# Altium project Led7Segment_Project.PrjPcb
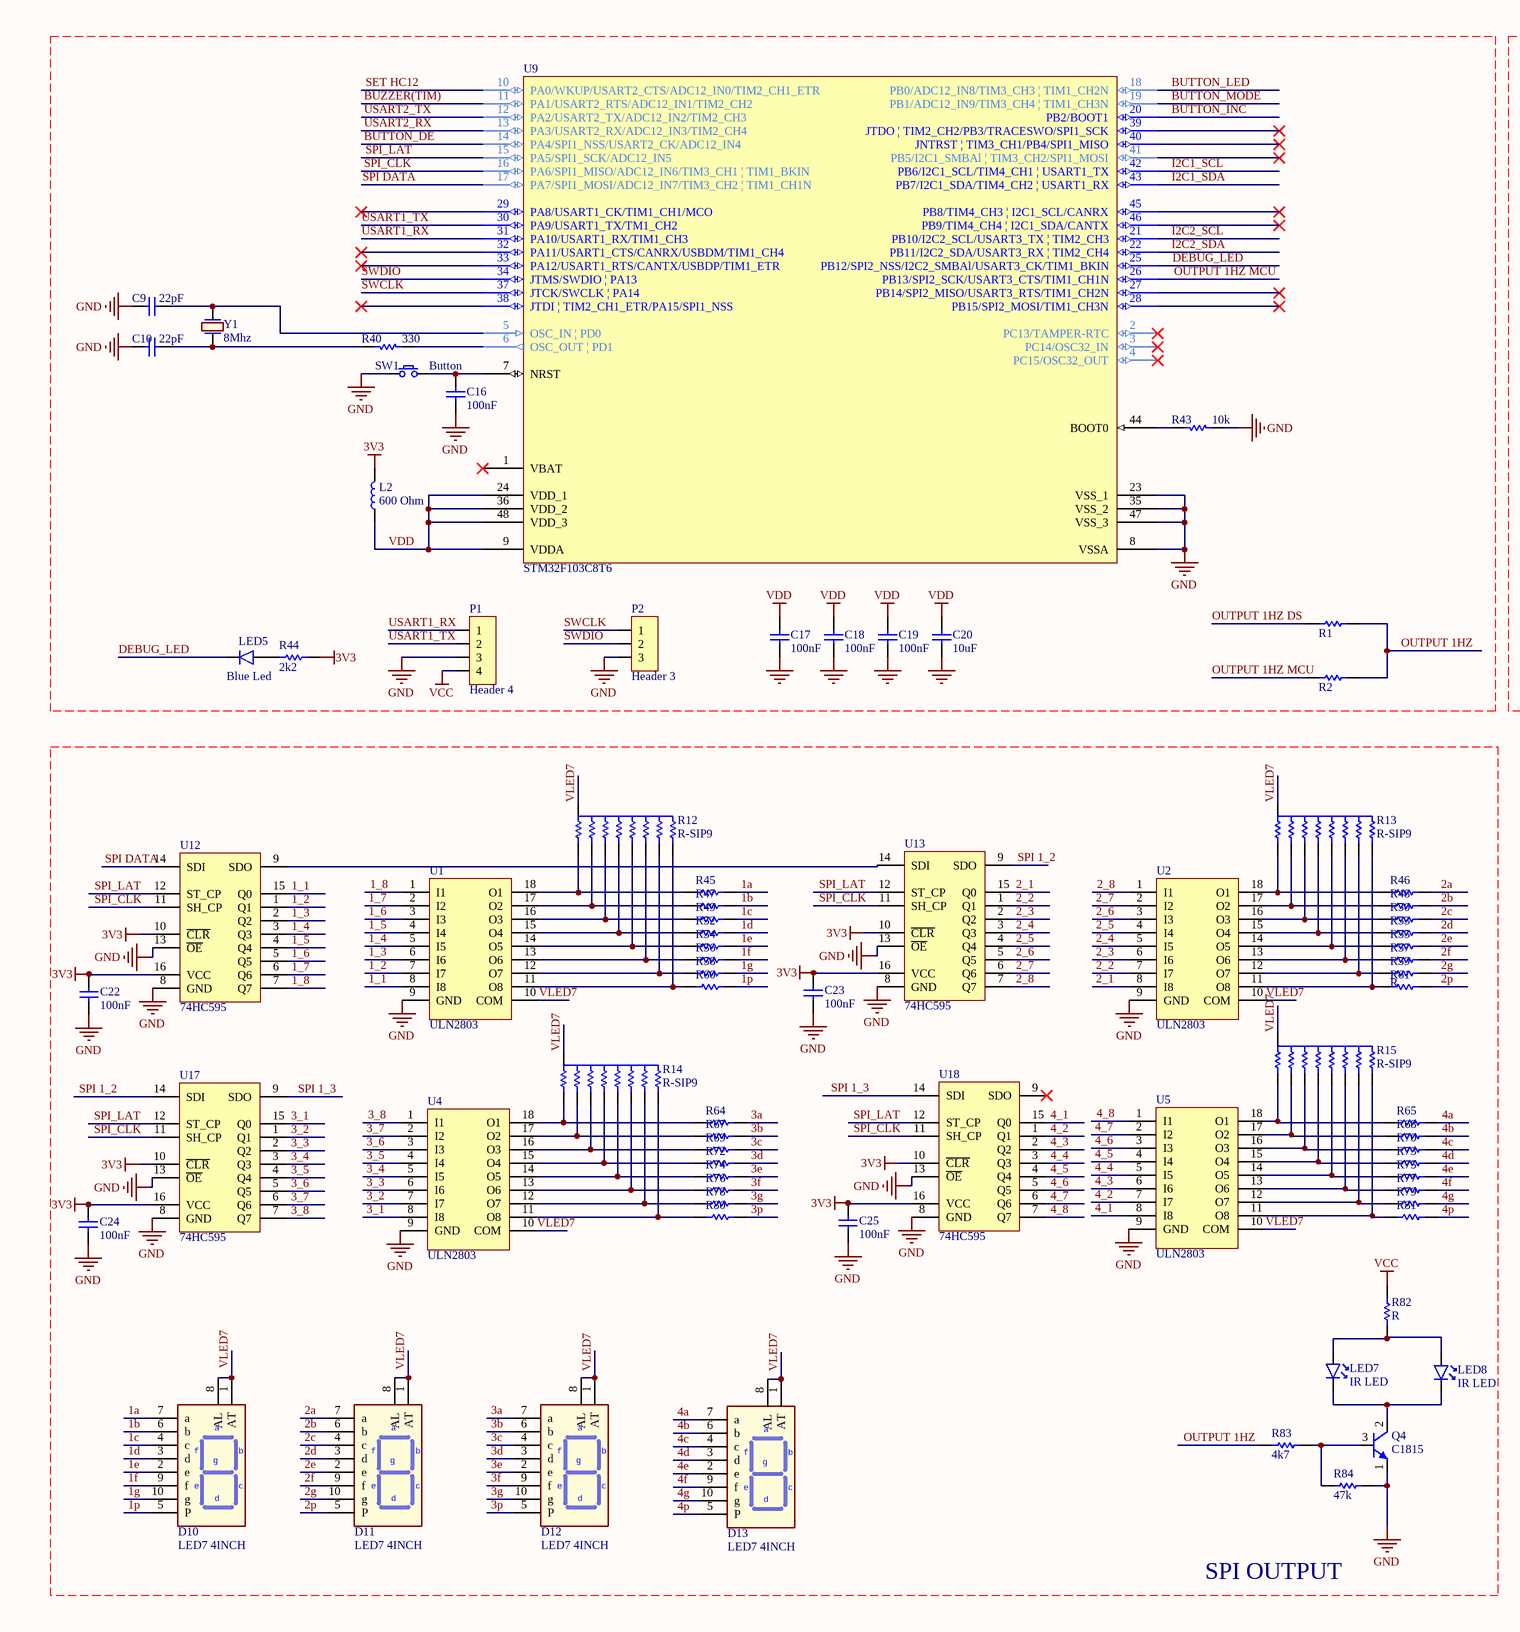
[diagram p0: MainBoard.SchDoc, left]
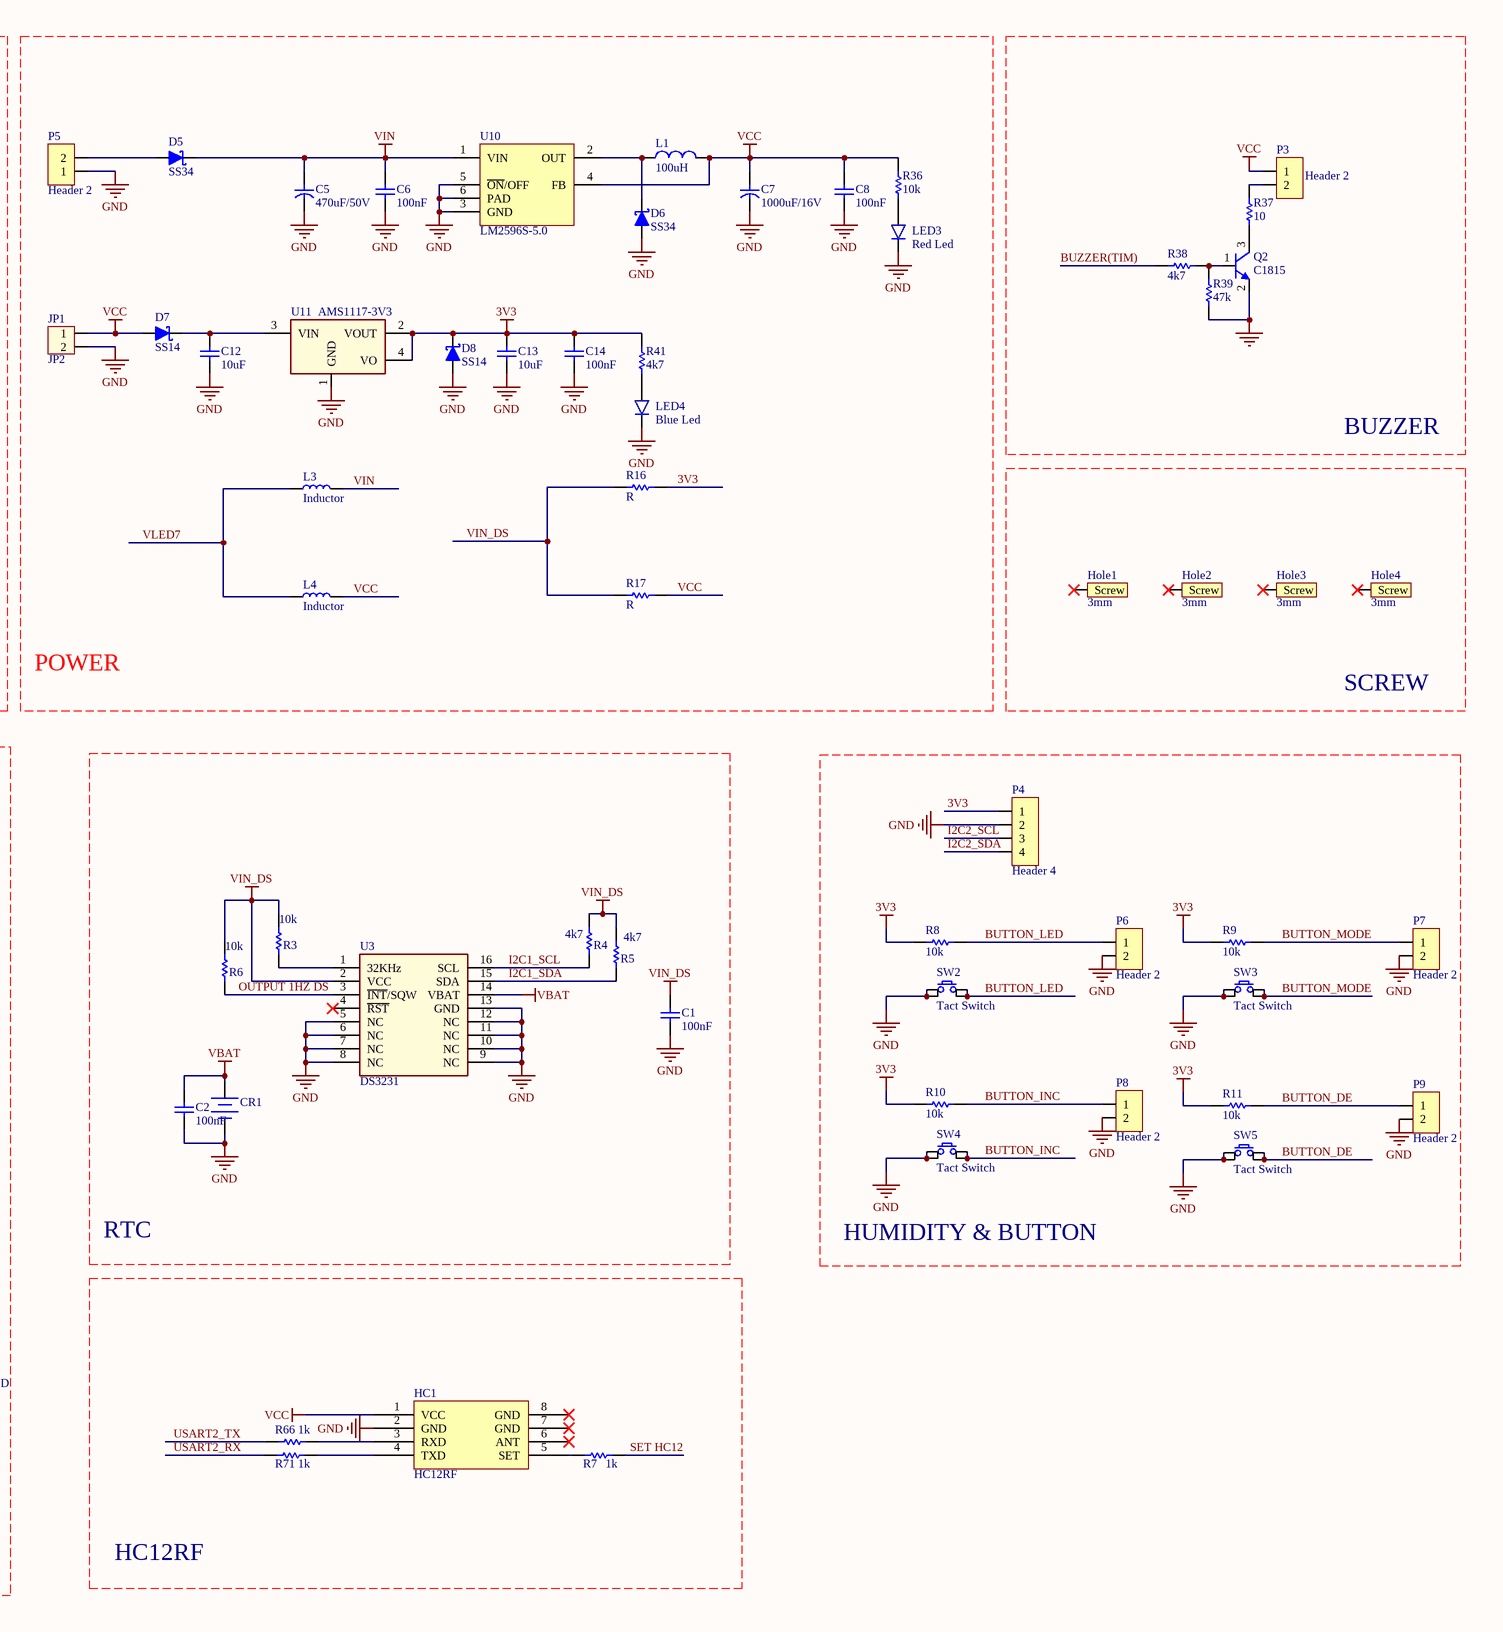
[diagram p1: MainBoard.SchDoc, right]
1 sheet, 135 parts. Net scope: global (net labels, ports and power ports of the same name join across sheets).
Board file: PCB_Project.PcbDoc

## Sheet MainBoard.SchDoc
size A2

### Parts
C1  100nF  [C 0805 (2012)]
C2  100nF  [C 0805 (2012)]
C5  470uF/50V  [CR/D.10.0x16.0/P.5.0]
C6  100nF  [C 0805 (2012)]
C7  1000uF/16V  [CR/D.10.0x12.5/P.5.0]
C8  100nF  [C 0805 (2012)]
C9  22pF  [C 0805 (2012)]
C10  22pF  [C 0805 (2012)]
C12  10uF  [C 0805 (2012)]
C13  10uF  [C 0805 (2012)]
C14  100nF  [C 0805 (2012)]
C16  100nF  [C 0805 (2012)]
C17  100nF  [C 0805 (2012)]
C18  100nF  [C 0805 (2012)]
C19  100nF  [C 0805 (2012)]
C20  10uF  [C 0805 (2012)]
C22  100nF  [C 0805 (2012)]
C23  100nF  [C 0805 (2012)]
C24  100nF  [C 0805 (2012)]
C25  100nF  [C 0805 (2012)]
CR1  (no value)  [CON CR1220]
D5  SS34  [DO-214AC (SMA)]
D6  SS34  [DO-214AC (SMA)]
D7  SS14  [DO-214AC (SMA)]
D8  SS14  [DO-214AC (SMA)]
D10  LED7 4INCH  [LED7 CA 4INCH]
D11  LED7 4INCH  [LED7 CA 4INCH]
D12  LED7 4INCH  [LED7 CA 4INCH]
D13  LED7 4INCH  [LED7 CA 4INCH]
HC1  HC12RF  [HC12RF]
Hole1  3mm  [SCREW/3M/7M]
Hole2  3mm  [SCREW/3M/7M]
Hole3  3mm  [SCREW/3M/7M]
Hole4  3mm  [SCREW/3M/7M]
JP1  JP2  [CON Header 2]
L1  100uH  [Inductor SMD 12x12x8]
L2  600 Ohm  [Inductor SMD 0805 (2012)]
L3  Inductor  [Inductor SMD 7.5x7.0x5.0]
L4  Inductor  [Inductor SMD 7.5x7.0x5.0]
LED3  Red Led  [Led SMD 0805]
LED4  Blue Led  [Led SMD 0805]
LED5  Blue Led  [Led SMD 0805]
LED7  IR LED  [LED 5MM]
LED8  IR LED  [LED 5MM]
P1  Header 4  [CON Header 4]
P2  Header 3  [Header 3]
P3  Header 2  [CON Header 2]
P4  Header 4  [Header 4]
P5  Header 2  [HDR Domino 2]
P6  Header 2  [CON Header 2]
P7  Header 2  [CON Header 2]
P8  Header 2  [CON Header 2]
P9  Header 2  [CON Header 2]
Q2  C1815  [SOT-23]
Q4  C1815  [SOT-23]
R1  R  [R 0805 (2012)]  (value not drawn)
R2  R  [R 0805 (2012)]  (value not drawn)
R3  10k  [R 0805 (2012)]
R4  4k7  [R 0805 (2012)]
R5  4k7  [R 0805 (2012)]
R6  10k  [R 0805 (2012)]
R7  1k  [R 0805 (2012)]
R8  10k  [R 0805 (2012)]
R9  10k  [R 0805 (2012)]
R10  10k  [R 0805 (2012)]
R11  10k  [R 0805 (2012)]
R12  R-SIP9  [R SIP9]
R13  R-SIP9  [R SIP9]
R14  R-SIP9  [R SIP9]
R15  R-SIP9  [R SIP9]
R16  R  [R 0805 (2012)]
R17  R  [R 0805 (2012)]
R36  10k  [R 0805 (2012)]
R37  10  [R 0805 (2012)]
R38  4k7  [R 0805 (2012)]
R39  47k  [R 0805 (2012)]
R40  330  [R 0805 (2012)]
R41  4k7  [R 0805 (2012)]
R43  10k  [R 0805 (2012)]
R44  2k2  [R 0805 (2012)]
R45  R  [R 0805 (2012)]  (value not drawn)
R46  R  [R 0805 (2012)]  (value not drawn)
R47  R  [R 0805 (2012)]  (value not drawn)
R48  R  [R 0805 (2012)]  (value not drawn)
R49  R  [R 0805 (2012)]  (value not drawn)
R50  R  [R 0805 (2012)]  (value not drawn)
R52  R  [R 0805 (2012)]  (value not drawn)
R53  R  [R 0805 (2012)]  (value not drawn)
R54  R  [R 0805 (2012)]  (value not drawn)
R55  R  [R 0805 (2012)]  (value not drawn)
R56  R  [R 0805 (2012)]  (value not drawn)
R57  R  [R 0805 (2012)]  (value not drawn)
R58  R  [R 0805 (2012)]  (value not drawn)
R59  R  [R 0805 (2012)]
R60  R  [R 0805 (2012)]  (value not drawn)
R61  R  [R 0805 (2012)]  (value not drawn)
R64  R  [R 0805 (2012)]  (value not drawn)
R65  R  [R 0805 (2012)]  (value not drawn)
R66  1k  [R 0805 (2012)]
R67  R  [R 0805 (2012)]  (value not drawn)
R68  R  [R 0805 (2012)]  (value not drawn)
R69  R  [R 0805 (2012)]  (value not drawn)
R70  R  [R 0805 (2012)]  (value not drawn)
R71  1k  [R 0805 (2012)]
R72  R  [R 0805 (2012)]  (value not drawn)
R73  R  [R 0805 (2012)]  (value not drawn)
R74  R  [R 0805 (2012)]  (value not drawn)
R75  R  [R 0805 (2012)]  (value not drawn)
R76  R  [R 0805 (2012)]  (value not drawn)
R77  R  [R 0805 (2012)]  (value not drawn)
R78  R  [R 0805 (2012)]  (value not drawn)
R79  R  [R 0805 (2012)]  (value not drawn)
R80  R  [R 0805 (2012)]  (value not drawn)
R81  R  [R 0805 (2012)]  (value not drawn)
R82  R  [R 0805 (2012)]
R83  4k7  [R 0805 (2012)]
R84  47k  [R 0805 (2012)]
SW1  Button  [SW/2/SMD]
SW2  Tact Switch  [SW/4/SMD/SMALL]
SW3  Tact Switch  [SW/4/SMD/SMALL]
SW4  Tact Switch  [SW/4/SMD/SMALL]
SW5  Tact Switch  [SW/4/SMD/SMALL]
U1  ULN2803  [SOIC-18]
U2  ULN2803  [SOIC-18]
U3  DS3231  [SOIC-16-WIDE]
U4  ULN2803  [SOIC-18]
U5  ULN2803  [SOIC-18]
U9  STM32F103C8T6  [LQFP48_N]
U10  LM2596S-5.0  [TO-263-5]
U11  AMS1117-3V3  [SOT-223]
U12  74HC595  [SOIC-16]
U13  74HC595  [SOIC-16]
U17  74HC595  [SOIC-16]
U18  74HC595  [SOIC-16]
Y1  8Mhz  [Crystal HC49US SMD]

### Nets
3V3: C13.1 C14.1 C22.1 C23.1 C24.1 C25.1 D8.2(K) L2.2 P4.1 R8.1 R9.1 R10.1 R11.1 R16.2 R41.2 R44.2 U11.2(VOUT) U11.4(VO) U12.10(~{CLR}) U12.16(VCC) U13.10(~{CLR}) U13.16(VCC) U17.10(~{CLR}) U17.16(VCC) U18.10(~{CLR}) U18.16(VCC)
GND: C1.2 C2.2 C5.2 C6.2 C7.2 C8.2 C9.2 C10.2 C12.2 C13.2 C14.2 C16.2 C17.2 C18.2 C19.2 C20.2 C22.2 C23.2 C24.2 C25.2 CR1.2(GND) D6.1(A) D8.1(A) HC1.2(GND) JP1.2 LED3.2(K) LED4.2(K) P1.3 P2.3 P4.2 P5.1 P6.2 P7.2 P8.2 P9.2 Q2.2(E) Q4.1(E) R39.2 R43.1 R84.2 SW1.1 SW2.1 SW2.4 SW3.1 SW3.4 SW4.1 SW4.4 SW5.1 SW5.4 U1.9(GND) U2.9(GND) U3.5(NC) U3.6(NC) U3.7(NC) U3.8(NC) U3.9(NC) U3.10(NC) U3.11(NC) U3.12(NC) U3.13(GND) U4.9(GND) U5.9(GND) U9.8(VSSA) U9.23(VSS_1) U9.35(VSS_2) U9.47(VSS_3) U10.3(GND) U10.5(~{ON}/OFF) U10.6(GND) U11.1(GND) U12.8(GND) U12.13(~{OE}) U13.8(GND) U13.13(~{OE}) U17.8(GND) U17.13(~{OE}) U18.8(GND) U18.13(~{OE})
VBAT: C2.1 CR1.1(VCC) U3.14(VBAT)
VCC: C7.1 C8.1 D7.1(A) HC1.1(VCC) JP1.1 L1.2 L4.2 P1.4 P3.1 R17.2 R36.2 R82.2 U10.4(FB)
VDD: C17.1 C18.1 C19.1 C20.1 L2.1 U9.9(VDDA) U9.24(VDD_1) U9.36(VDD_2) U9.48(VDD_3)
VIN: C5.1 C6.1 D5.2(K) L3.2 U10.1(VIN)
VIN_DS: C1.1 R3.1 R4.2 R5.2 R6.2 R16.1 R17.1 U3.2(VCC)
1_1: U1.8(I8) U12.15(Q0)
1_2: U1.7(I7) U12.1(Q1)
1_3: U1.6(I6) U12.2(Q2)
1_4: U1.5(I5) U12.3(Q3)
1_5: U1.4(I4) U12.4(Q4)
1_6: U1.3(I3) U12.5(Q5)
1_7: U1.2(I2) U12.6(Q6)
1_8: U1.1(I1) U12.7(Q7)
1a: D10.7(a) R45.2
1b: D10.6(b) R47.2
1c: D10.4(c) R49.2
1d: D10.3(d) R52.2
1e: D10.2(e) R54.2
1f: D10.9(f) R56.2
1g: D10.10(g) R58.2
1p: D10.5(P) R60.2
2_1: U2.8(I8) U13.15(Q0)
2_2: U2.7(I7) U13.1(Q1)
2_3: U2.6(I6) U13.2(Q2)
2_4: U2.5(I5) U13.3(Q3)
2_5: U2.4(I4) U13.4(Q4)
2_6: U2.3(I3) U13.5(Q5)
2_7: U2.2(I2) U13.6(Q6)
2_8: U2.1(I1) U13.7(Q7)
2a: D11.7(a) R46.2
2b: D11.6(b) R48.2
2c: D11.4(c) R50.2
2d: D11.3(d) R53.2
2e: D11.2(e) R55.2
2f: D11.9(f) R57.2
2g: D11.10(g) R59.2
2p: D11.5(P) R61.2
3_1: U4.8(I8) U17.15(Q0)
3_2: U4.7(I7) U17.1(Q1)
3_3: U4.6(I6) U17.2(Q2)
3_4: U4.5(I5) U17.3(Q3)
3_5: U4.4(I4) U17.4(Q4)
3_6: U4.3(I3) U17.5(Q5)
3_7: U4.2(I2) U17.6(Q6)
3_8: U4.1(I1) U17.7(Q7)
3a: D12.7(a) R64.2
3b: D12.6(b) R67.2
3c: D12.4(c) R69.2
3d: D12.3(d) R72.2
3e: D12.2(e) R74.2
3f: D12.9(f) R76.2
3g: D12.10(g) R78.2
3p: D12.5(P) R80.2
4_1: U5.8(I8) U18.15(Q0)
4_2: U5.7(I7) U18.1(Q1)
4_3: U5.6(I6) U18.2(Q2)
4_4: U5.5(I5) U18.3(Q3)
4_5: U5.4(I4) U18.4(Q4)
4_6: U5.3(I3) U18.5(Q5)
4_7: U5.2(I2) U18.6(Q6)
4_8: U5.1(I1) U18.7(Q7)
4a: D13.7(a) R65.2
4b: D13.6(b) R68.2
4c: D13.4(c) R70.2
4d: D13.3(d) R73.2
4e: D13.2(e) R75.2
4f: D13.9(f) R77.2
4g: D13.10(g) R79.2
4p: D13.5(P) R81.2
BUTTON_DE: P9.1 R11.2 SW5.2 SW5.3 U9.14(PA4/SPI1_NSS/USART2_CK/ADC12_IN4)
BUTTON_INC: P8.1 R10.2 SW4.2 SW4.3 U9.20(PB2/BOOT1)
BUTTON_LED: P6.1 R8.2 SW2.2 SW2.3 U9.18(PB0/ADC12_IN8/TIM3_CH3_|_TIM1_CH2N)
BUTTON_MODE: P7.1 R9.2 SW3.2 SW3.3 U9.19(PB1/ADC12_IN9/TIM3_CH4_|_TIM1_CH3N)
BUZZER(TIM): R38.2 U9.11(PA1/USART2_RTS/ADC12_IN1/TIM2_CH2)
DEBUG_LED: LED5.2(K) U9.25(PB12/SPI2_NSS/I2C2_SMBAl/USART3_CK/TIM1_BKIN)
I2C1_SCL: R4.1 U3.16(SCL) U9.42(PB6/I2C1_SCL/TIM4_CH1_|_USART1_TX)
I2C1_SDA: R5.1 U3.15(SDA) U9.43(PB7/I2C1_SDA/TIM4_CH2_|_USART1_RX)
I2C2_SCL: P4.3 U9.21(PB10/I2C2_SCL/USART3_TX_|_TIM2_CH3)
I2C2_SDA: P4.4 U9.22(PB11/I2C2_SDA/USART3_RX_|_TIM2_CH4)
OUTPUT 1HZ: R1.1 R2.1 R83.1
OUTPUT 1HZ DS: R1.2 R6.1 U3.3(~{INT}/SQW)
OUTPUT 1HZ MCU: R2.2 U9.26(PB13/SPI2_SCK/USART3_CTS/TIM1_CH1N)
SET HC12: R7.2 U9.10(PA0/WKUP/USART2_CTS/ADC12_IN0/TIM2_CH1_ETR)
SPI 1_2: U13.9(SDO) U17.14(SDI)
SPI 1_3: U17.9(SDO) U18.14(SDI)
SPI DATA: U9.17(PA7/SPI1_MOSI/ADC12_IN7/TIM3_CH2_|_TIM1_CH1N) U12.14(SDI)
SPI_CLK: U9.16(PA6/SPI1_MISO/ADC12_IN6/TIM3_CH1_|_TIM1_BKIN) U12.11(SH_CP) U13.11(SH_CP) U17.11(SH_CP) U18.11(SH_CP)
SPI_LAT: U9.15(PA5/SPI1_SCK/ADC12_IN5) U12.12(ST_CP) U13.12(ST_CP) U17.12(ST_CP) U18.12(ST_CP)
SWCLK: P2.1 U9.37(JTCK/SWCLK_|_PA14)
SWDIO: P2.2 U9.34(JTMS/SWDIO_|_PA13)
USART1_RX: P1.1 U9.31(PA10/USART1_RX/TIM1_CH3)
USART1_TX: P1.2 U9.30(PA9/USART1_TX/TM1_CH2)
USART2_RX: R71.1 U9.13(PA3/USART2_RX/ADC12_IN3/TIM2_CH4)
USART2_TX: R66.1 U9.12(PA2/USART2_TX/ADC12_IN2/TIM2_CH3)
VLED7: D10.1(AT) D10.8(AL) D11.1(AT) D11.8(AL) D12.1(AT) D12.8(AL) D13.1(AT) D13.8(AL) L3.1 L4.1 R12.1 R13.1 R14.1 R15.1 U1.10(COM) U2.10(COM) U4.10(COM) U5.10(COM)
NetC9_1: C9.1 U9.5(OSC_IN_|_PD0) Y1.2
NetC10_1: C10.1 R40.2 Y1.1
NetC12_1: C12.1 D7.2(K) U11.3(VIN)
NetC16_1: C16.1 SW1.2 U9.7(NRST)
NetD5_1: D5.1(A) P5.2
NetD6_2: D6.2(K) L1.1 U10.2(OUT)
NetHC1_3: HC1.3(RXD) R66.2
NetHC1_4: HC1.4(TXD) R71.2
NetHC1_5: HC1.5(SET) R7.1
NetLED3_1: LED3.1(A) R36.1
NetLED4_1: LED4.1(A) R41.1
NetLED5_1: LED5.1(A) R44.1
NetLED7_1: LED7.1(A) LED8.1(A) R82.1
NetLED7_2: LED7.2(K) LED8.2(K) Q4.2(C)
NetP3_2: P3.2 R37.2
NetQ2_1: Q2.1(B) R38.1 R39.1
NetQ2_3: Q2.3(C) R37.1
NetQ4_3: Q4.3(B) R83.2 R84.1
NetR3_2: R3.2 U3.1(32KHz)
NetR12_2: R12.2 R45.1 U1.18(O1)
NetR12_3: R12.3 R47.1 U1.17(O2)
NetR12_4: R12.4 R49.1 U1.16(O3)
NetR12_5: R12.5 R52.1 U1.15(O4)
NetR12_6: R12.6 R54.1 U1.14(O5)
NetR12_7: R12.7 R56.1 U1.13(O6)
NetR12_8: R12.8 R58.1 U1.12(O7)
NetR12_9: R12.9 R60.1 U1.11(O8)
NetR13_2: R13.2 R46.1 U2.18(O1)
NetR13_3: R13.3 R48.1 U2.17(O2)
NetR13_4: R13.4 R50.1 U2.16(O3)
NetR13_5: R13.5 R53.1 U2.15(O4)
NetR13_6: R13.6 R55.1 U2.14(O5)
NetR13_7: R13.7 R57.1 U2.13(O6)
NetR13_8: R13.8 R59.1 U2.12(O7)
NetR13_9: R13.9 R61.1 U2.11(O8)
NetR14_2: R14.2 R64.1 U4.18(O1)
NetR14_3: R14.3 R67.1 U4.17(O2)
NetR14_4: R14.4 R69.1 U4.16(O3)
NetR14_5: R14.5 R72.1 U4.15(O4)
NetR14_6: R14.6 R74.1 U4.14(O5)
NetR14_7: R14.7 R76.1 U4.13(O6)
NetR14_8: R14.8 R78.1 U4.12(O7)
NetR14_9: R14.9 R80.1 U4.11(O8)
NetR15_2: R15.2 R65.1 U5.18(O1)
NetR15_3: R15.3 R68.1 U5.17(O2)
NetR15_4: R15.4 R70.1 U5.16(O3)
NetR15_5: R15.5 R73.1 U5.15(O4)
NetR15_6: R15.6 R75.1 U5.14(O5)
NetR15_7: R15.7 R77.1 U5.13(O6)
NetR15_8: R15.8 R79.1 U5.12(O7)
NetR15_9: R15.9 R81.1 U5.11(O8)
NetR40_1: R40.1 U9.6(OSC_OUT_|_PD1)
NetR43_2: R43.2 U9.44(BOOT0)
NetU12_9: U12.9(SDO) U13.14(SDI)

Not connected (* = marked no-connect by the designer): HC1 6(ANT)* 7(GND)* 8(GND)*; Hole1 1(Screw)*; Hole2 1(Screw)*; Hole3 1(Screw)*; Hole4 1(Screw)*; U3 4(~{RST})*; U9 1(VBAT)* 2(PC13/TAMPER-RTC)* 3(PC14/OSC32_IN)* 4(PC15/OSC32_OUT)* 27(PB14/SPI2_MISO/USART3_RTS/TIM1_CH2N)* 28(PB15/SPI2_MOSI/TIM1_CH3N)* 29(PA8/USART1_CK/TIM1_CH1/MCO)* 32(PA11/USART1_CTS/CANRX/USBDM/TIM1_CH4)* 33(PA12/USART1_RTS/CANTX/USBDP/TIM1_ETR)* 38(JTDI_|_TIM2_CH1_ETR/PA15/SPI1_NSS)* 39(JTDO_|_TIM2_CH2/PB3/TRACESWO/SPI1_SCK)* 40(JNTRST_|_TIM3_CH1/PB4/SPI1_MISO)* 41(PB5/I2C1_SMBAl_|_TIM3_CH2/SPI1_MOSI)* 45(PB8/TIM4_CH3_|_I2C1_SCL/CANRX)* 46(PB9/TIM4_CH4_|_I2C1_SDA/CANTX)*; U18 9(SDO)*

### Notes on the sheet
- BUZZER
- POWER
- SCREW
- RTC
- HUMIDITY & BUTTON
- SPI OUTPUT
- HC12RF
- Title
- Size:
- Date:
- File:
- A2
- Number:
- Time:
- Revision:
- Sheet
- of

### Library data of the parts
C1 C2 C6 C8-C10 C12-C14 C16-C20 C22-C25 = Capacitor NP: Capacitor non-pol
C5 C7 = Capacitor: Capacitor pol
CR1 = Battery
D5-D8 = Diode Schottky: Schottky Diode; Published: 8-Jun-2000; LatestRevisionDate: 17-Jul-2002; LatestRevisionNote: Re-released for DXP Platform.; PackageReference: SMB; Publisher: Altium Limited; Code_JEDEC: DO-214-AA
Hole1-Hole4 = Screw
JP1 = Con2: Connector 2; Value: Connector 2
L1 = L1: Inductor; Value: 150 mH
L2 = Inductor
LED3-LED5 = Led: Typical LED
P1 P4 = Header 4: Header, 4-Pin
P2 = Header 3: Header, 3-Pin
P3 P5-P9 = Header 2: Header, 2-Pin; LatestRevisionDate: 17-Jul-2002; LatestRevisionNote: Re-released for DXP Platform.; Publisher: Altium Limited
Q2 = Transistor NPN: NPN Bipolar Transistor
Q4 = Transistor NPN - C1815: NPN Bipolar Transistor
R1-R11 R16 R17 R36-R41 R43-R50 R52-R61 R64-R84 = Resistor: Published: 8-Jun-2000; LatestRevisionDate: 17-Jul-2002; LatestRevisionNote: Re-released for DXP Platform.; PackageReference: AXIAL-0.3; Publisher: Altium Limited
R12-R15 = Resistor Sip9: Resistor; Published: 8-Jun-2000; LatestRevisionDate: 17-Jul-2002; LatestRevisionNote: Re-released for DXP Platform.; PackageReference: AXIAL-0.3; Publisher: Altium Limited
SW1 = SW SPST: Tact switch 2 pin
SW2-SW5 = SW SPST-4: Tact switch 4 pin
U1 U2 U4 U5 = ULN2803: High-voltage, high-current Darlington transistor arrays
U9 = STM32F103C8T6: STM32 ARM-based 32-bit MCU with 64 Kbytes Flash, 48-pin LQFP, Industrial Temperature; Published: 30-May-2008; DatasheetVersion: rev6, Mar-2008; PackageVersion: Mar-2008; PackageReference: LQFP48; Publisher: Altium Limited; PackageDescription: 48-Pin Low-Profile Quad Flat Pack, 7 x 7 mm Body, 0.5 mm Pitch (LQFP48); ComponentLink1Description: Manufacturer Link; ComponentLink1URL: www.st.com/stm32; ComponentLink2Description: Datasheet; ComponentLink2URL: http://www.st.com/stonline/products/literature/ds/13587.pdf
U10 = LM2576/96: SIMPLE SWITCHER® 3A Step-Down Voltage Regulator
U11 = AMS1117: 1A LDO Voltage Regulator, ADJ or fixed 1.5/1.8/2.5/2.85/3.3/5V
U12 U13 U17 U18 = 74HC595: 8-bit serial-in, serial or parallel-out  shift register with output latches;  3-state
Y1 = Crystal
LED7 LED8 = IR Led: Published: 8-Jun-2000; LatestRevisionDate: 17-Jul-2002; LatestRevisionNote: Re-released for DXP Platform.; PackageReference: AXIAL-0.3; Publisher: Altium Limited